# EAGLE design shield (EAGLE 6.6.0)

## Sheet 1 of 5
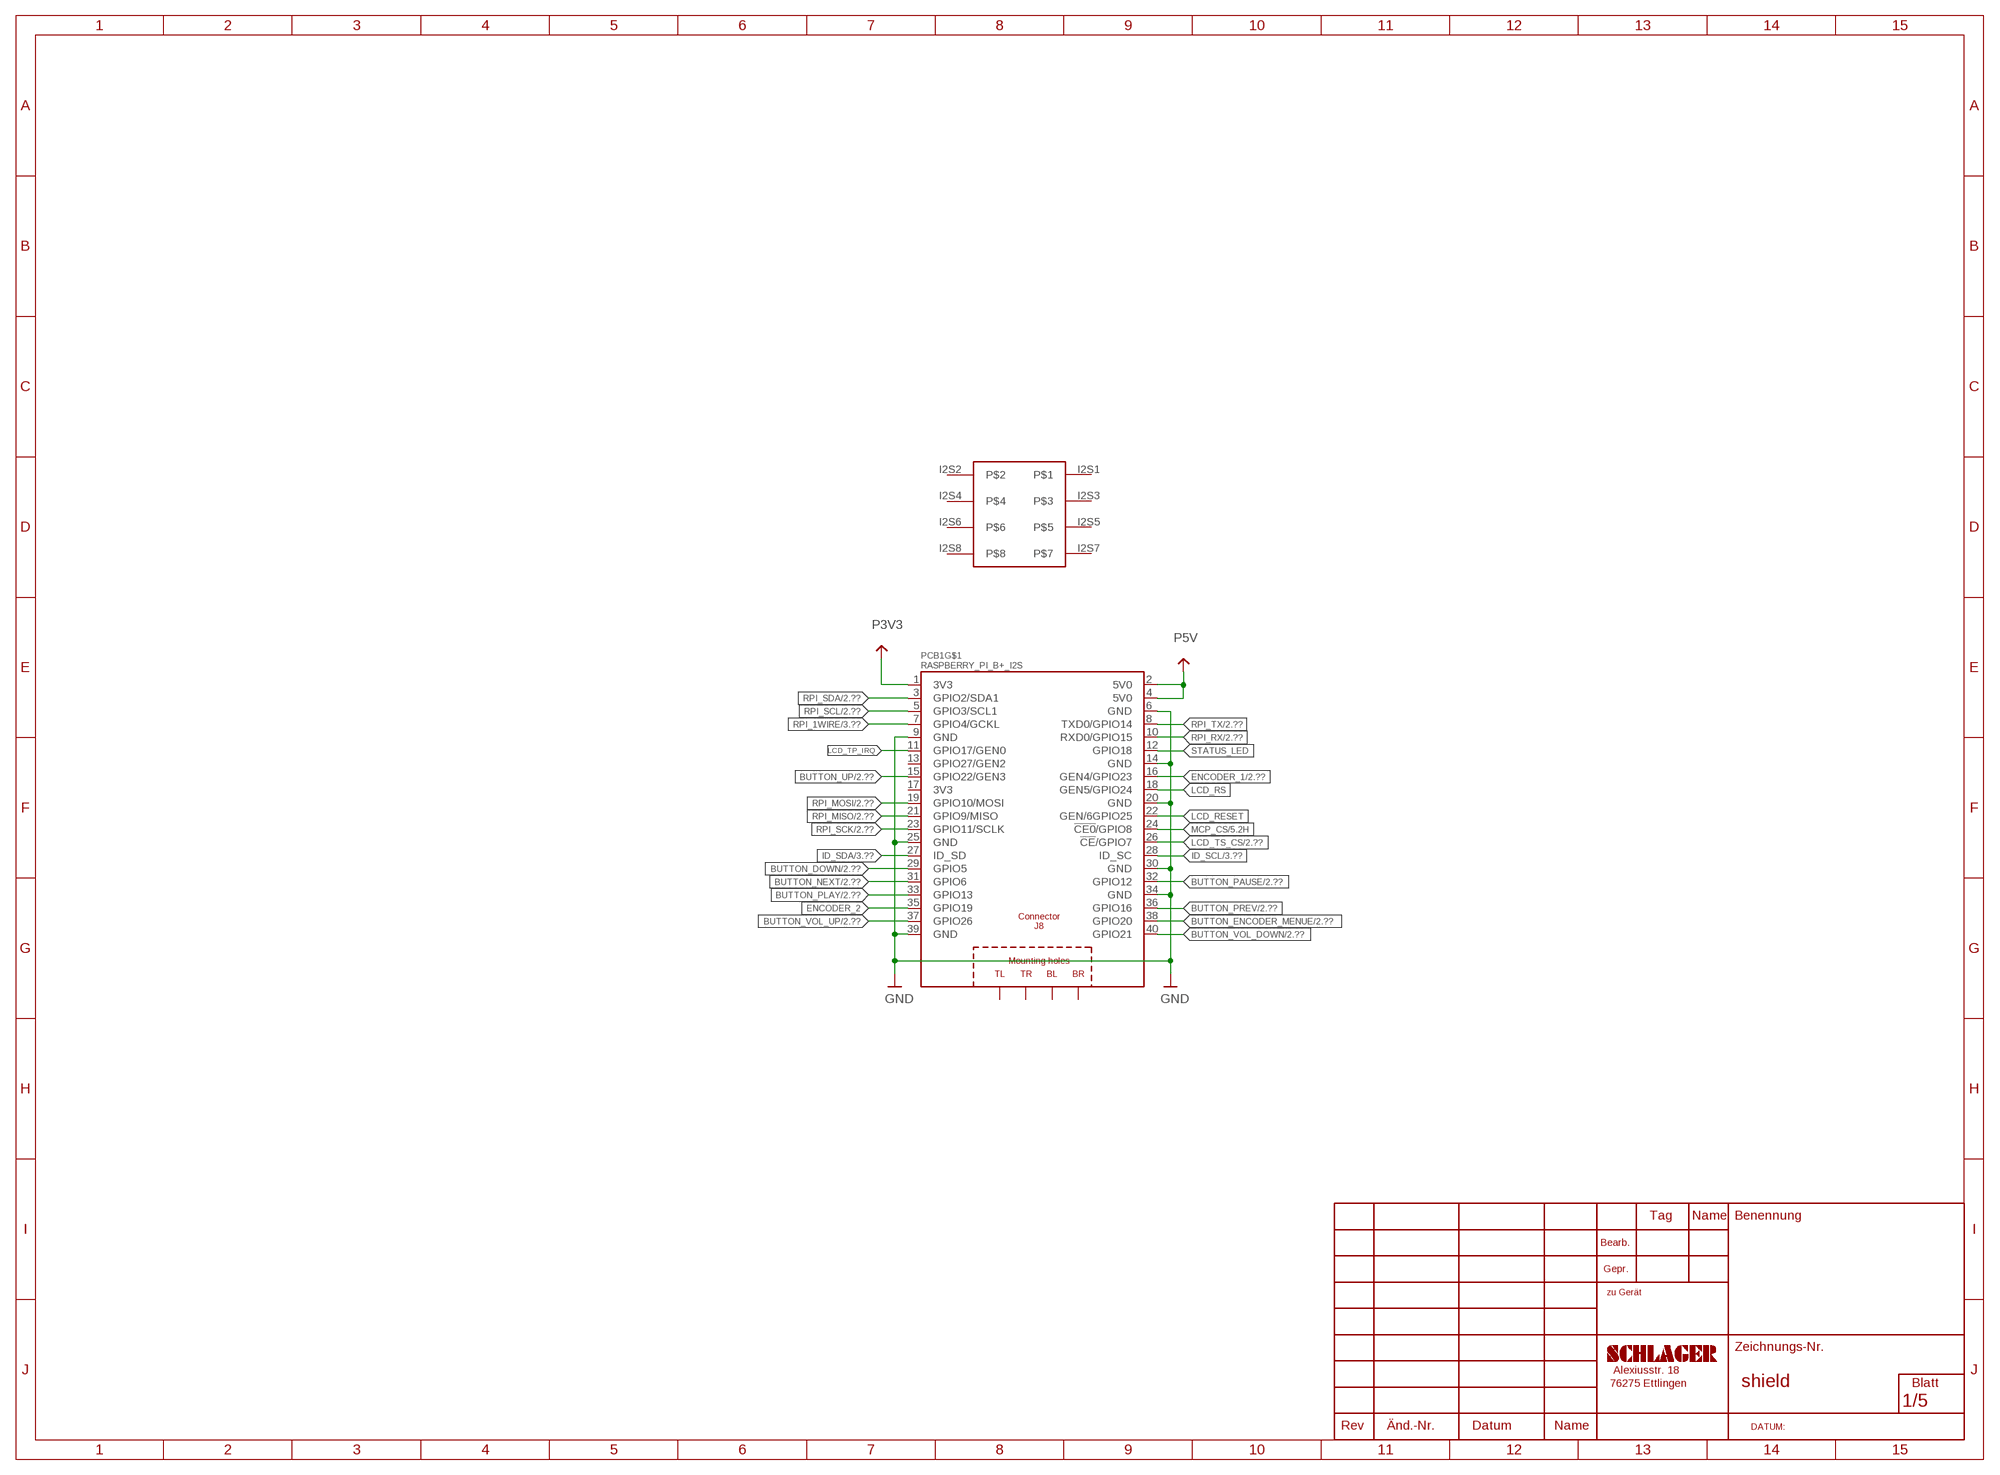
[diagram p0: schematic, sheet 1]

### Parts
PCB1  RASPBERRY_PI_B+_I2S  [RASPBERRY_PI_B+_I2S]

### Nets
BUTTON_DOWN: PCB1.29(GPIO5) ; also sheet 2
BUTTON_ENCODER_MENUE: PCB1.38(GPIO20) ; also sheet 2
BUTTON_NEXT: PCB1.31(GPIO6) ; also sheet 2
BUTTON_PAUSE: PCB1.32(GPIO12) ; also sheet 2
BUTTON_PLAY: PCB1.33(GPIO13) ; also sheet 2
BUTTON_PREV: PCB1.36(GPIO16) ; also sheet 2
BUTTON_UP: PCB1.15(GPIO22/GEN3) ; also sheet 2
BUTTON_VOL_DOWN: PCB1.40(GPIO21) ; also sheet 2
BUTTON_VOL_UP: PCB1.37(GPIO26) ; also sheet 2
ENCODER_1: PCB1.16(GEN4/GPIO23) ; also sheet 2
ENCODER_2: PCB1.35(GPIO19)
GND: PCB1.6(GND) PCB1.9(GND) PCB1.14(GND) PCB1.20(GND) PCB1.25(GND) PCB1.30(GND) PCB1.34(GND) PCB1.39(GND) ; also sheet 2,3,4,5
ID_SCL: PCB1.28(ID_SC) ; also sheet 3
ID_SDA: PCB1.27(ID_SD) ; also sheet 3
LCD_RESET: PCB1.22(GEN/6GPIO25)
LCD_RS: PCB1.18(GEN5/GPIO24)
LCD_TP_IRQ: PCB1.11(GPIO17/GEN0)
LCD_TS_CS: PCB1.26(!CE!/GPIO7) ; also sheet 2
MCP_CS: PCB1.24(!CE0!/GPIO8) ; also sheet 5
P3V3: PCB1.1(3V3) ; also sheet 2,3,5
P5V: PCB1.2(5V0) PCB1.4(5V0) ; also sheet 4,5
RPI_1WIRE: PCB1.7(GPIO4/GCKL) ; also sheet 3
RPI_MISO: PCB1.21(GPIO9/MISO) ; also sheet 2,5
RPI_MOSI: PCB1.19(GPIO10/MOSI) ; also sheet 2,5
RPI_RX: PCB1.10(RXD0/GPIO15) ; also sheet 2
RPI_SCK: PCB1.23(GPIO11/SCLK) ; also sheet 2,5
RPI_SCL: PCB1.5(GPIO3/SCL1) ; also sheet 2,3
RPI_SDA: PCB1.3(GPIO2/SDA1) ; also sheet 2,3
RPI_TX: PCB1.8(TXD0/GPIO14) ; also sheet 2
STATUS_LED: PCB1.12(GPIO18) ; also sheet 3
Unconnected: PCB1.13(GPIO27/GEN2) PCB1.17(3V3) PCB1.I2S1 PCB1.I2S2 PCB1.I2S3 PCB1.I2S4 PCB1.I2S5 PCB1.I2S6 PCB1.I2S7 PCB1.I2S8 PCB1.PE_BL(BL) PCB1.PE_BR(BR) PCB1.PE_TL(TL) PCB1.PE_TR(TR)

## Sheet 2 of 5
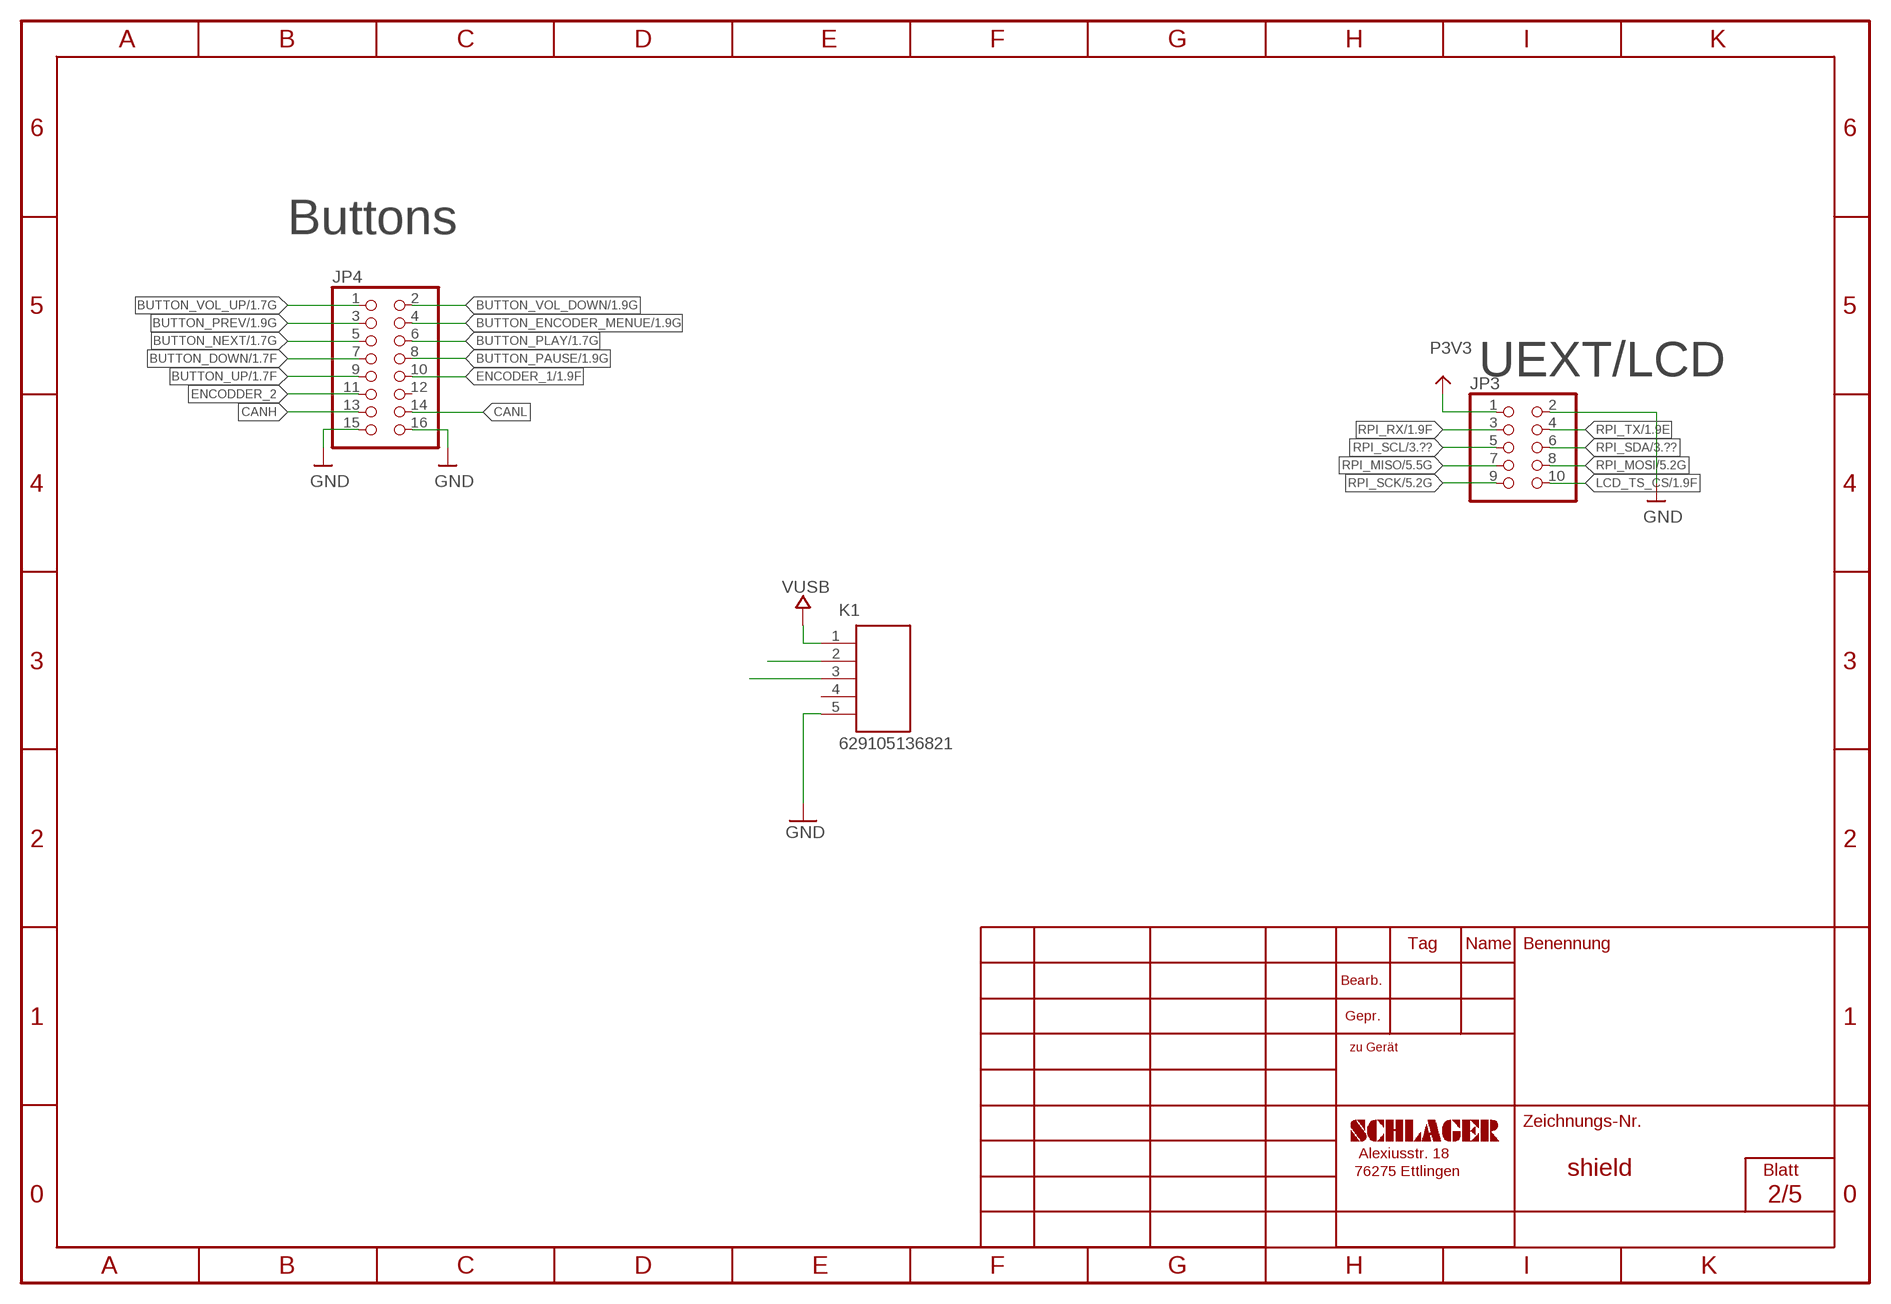
[diagram p1: schematic, sheet 2]

### Parts
JP3  PINHD-2X5/90  [2X05/90]
JP4  PINHD-2X8/90  [2X08/90]
K1  629105136821  [629105136821]

### Nets
BUTTON_DOWN: JP4.7 ; also sheet 1
BUTTON_ENCODER_MENUE: JP4.4 ; also sheet 1
BUTTON_NEXT: JP4.5 ; also sheet 1
BUTTON_PAUSE: JP4.8 ; also sheet 1
BUTTON_PLAY: JP4.6 ; also sheet 1
BUTTON_PREV: JP4.3 ; also sheet 1
BUTTON_UP: JP4.9 ; also sheet 1
BUTTON_VOL_DOWN: JP4.2 ; also sheet 1
BUTTON_VOL_UP: JP4.1 ; also sheet 1
CANH: JP4.13 ; also sheet 5
CANL: JP4.14 ; also sheet 5
ENCODDER_2: JP4.11
ENCODER_1: JP4.10 ; also sheet 1
GND: JP3.2 JP4.15 JP4.16 K1.5 ; also sheet 1,3,4,5
LCD_TS_CS: JP3.10 ; also sheet 1
N$8: K1.3
N$11: K1.2
P3V3: JP3.1 ; also sheet 1,3,5
RPI_MISO: JP3.7 ; also sheet 1,5
RPI_MOSI: JP3.8 ; also sheet 1,5
RPI_RX: JP3.3 ; also sheet 1
RPI_SCK: JP3.9 ; also sheet 1,5
RPI_SCL: JP3.5 ; also sheet 1,3
RPI_SDA: JP3.6 ; also sheet 1,3
RPI_TX: JP3.4 ; also sheet 1
VUSB: K1.1 ; also sheet 4
Unconnected: JP4.12 K1.4

### Notes on the sheet
- Buttons
- UEXT/LCD

## Sheet 3 of 5: 1wire
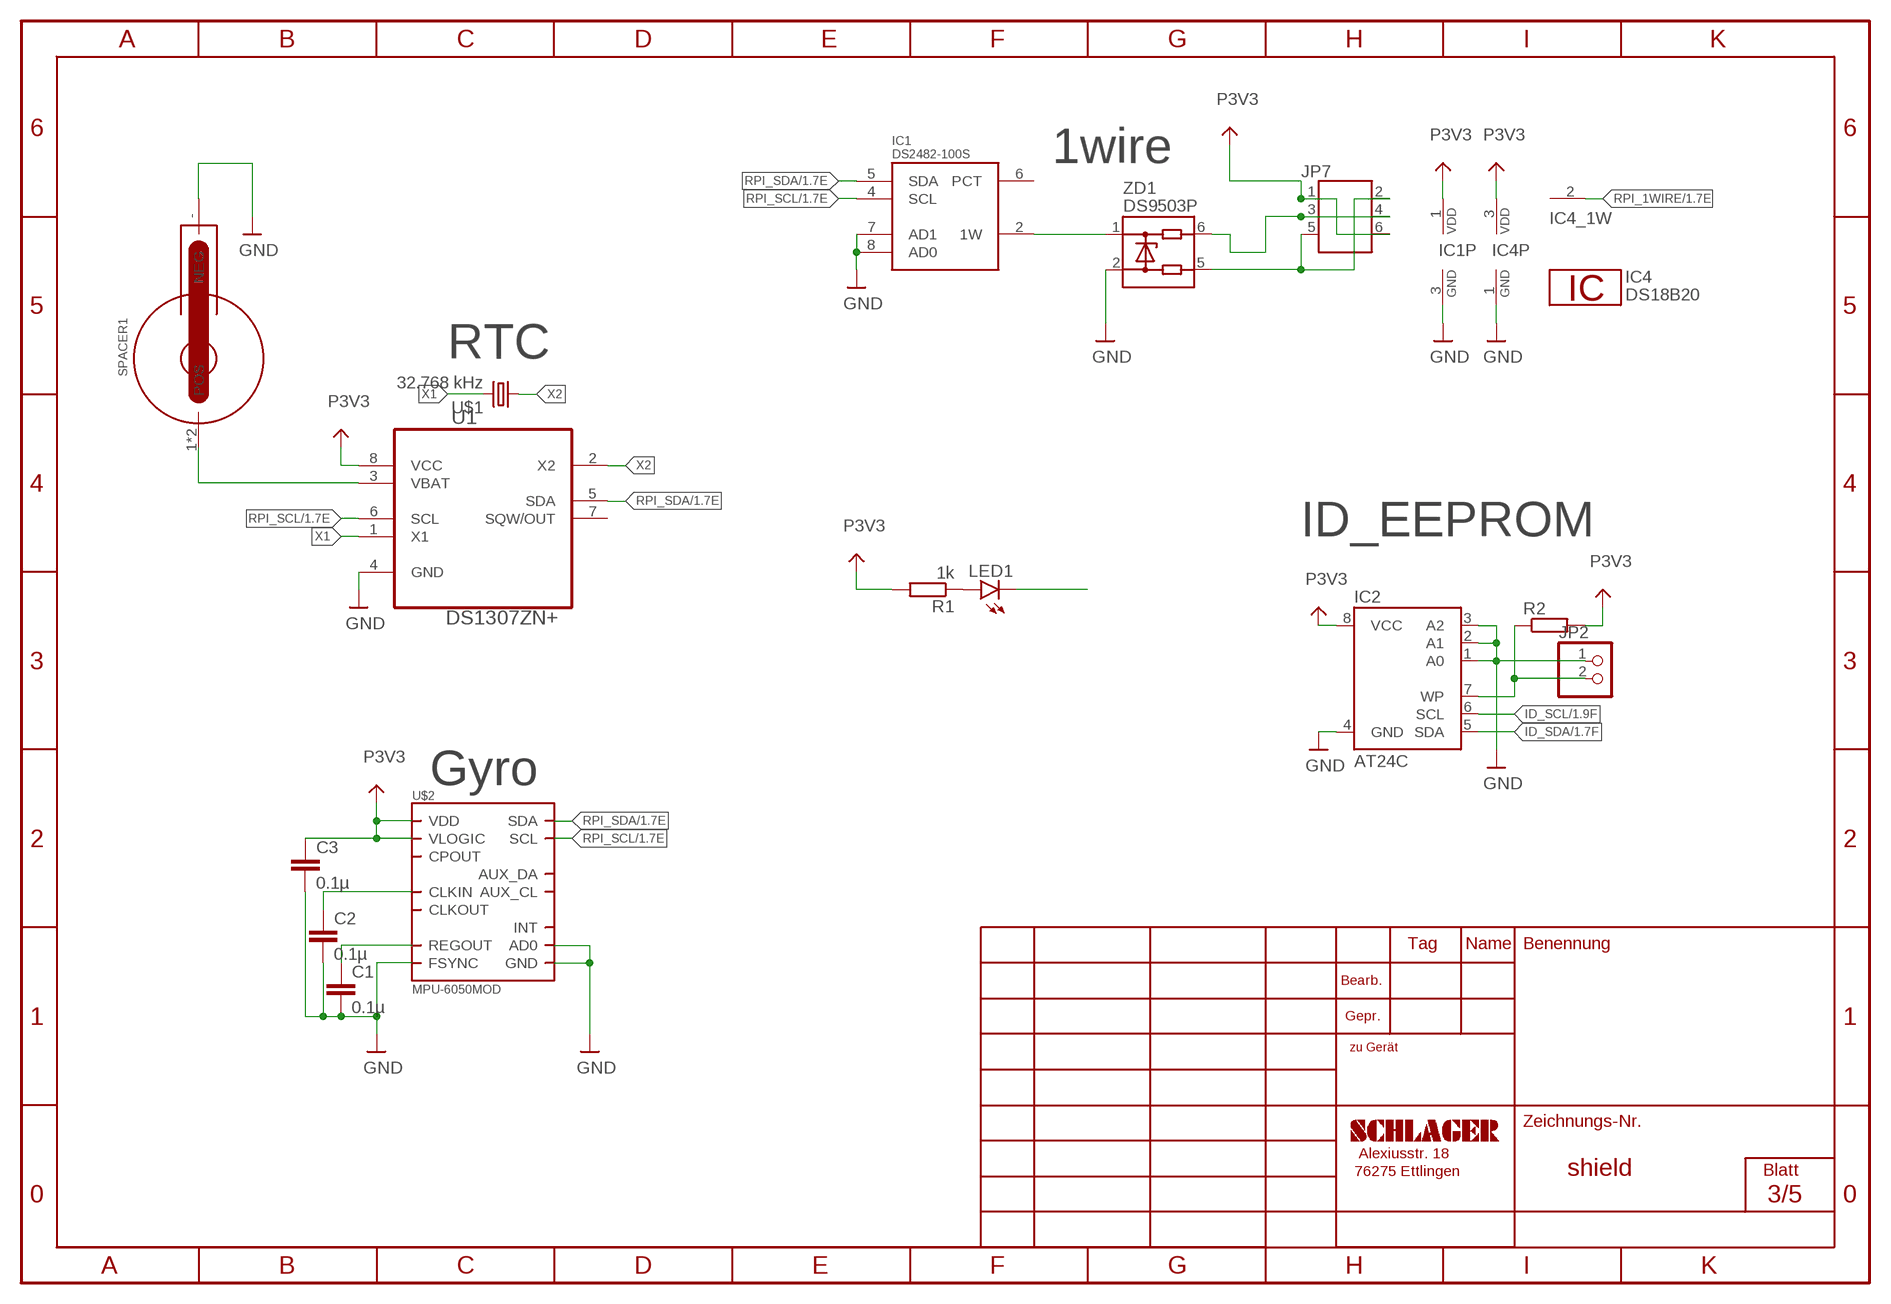
[diagram p2: schematic, sheet 3]

### Parts
C1  0.1µ  C-EUC0603K  [C0603K]
C2  0.1µ  C-EUC0603K  [C0603K]
C3  0.1µ  C-EUC0603K  [C0603K]
IC1  DS2482-100S  [SO08]
IC2  AT24C  [SO08]
IC4  DS18B20  [TO92-]
JP2  PINHD-1X2  [1X02]
JP7  610106249121"  [610106249121]
LED1  LED0603  [LED-0603]
R1  1k  R-EU_R0603  [R0603]
R2  R-EU_R0603  [R0603]
SPACER1  WA-BCMC_SMT_79523141  [79523141]
U1  DS1307ZN+  [SOIC127P600X175-8N]
U$1  32.768 kHz  CC5V-12,5  [CC5]
U$2  MPU-6050MOD  [QFN.24.4X4.MOD]
ZD1  DS9503P  [TSOC6]

### Nets
GND: C1.2 C2.2 C3.2 IC1.3(GND) IC1.7(AD1) IC1.8(AD0) IC2.1(A0) IC2.2(A1) IC2.3(A2) IC2.4(GND) IC4.1 JP2.1 SPACER1.-(NEG) U1.4(GND) U$2.9(AD0) U$2.11(FSYNC) U$2.18(GND) ZD1.2 ; also sheet 1,2,4,5
ID_SCL: IC2.6(SCL) ; also sheet 1
ID_SDA: IC2.5(SDA) ; also sheet 1
N$1: SPACER1.1(POS) SPACER1.2(POS) U1.3(VBAT)
N$2: JP7.2 JP7.5 ZD1.5
N$3: C1.1 U$2.10(REGOUT)
N$4: C2.1 U$2.1(CLKIN)
N$5: IC2.7(WP) JP2.2 R2.1
N$7: LED1.A R1.1
N$10: IC1.2(1W) ZD1.1
N$16: JP7.3 JP7.4 ZD1.6
P3V3: C3.1 IC1.1(VDD) IC2.8(VCC) IC4.3 JP7.1 JP7.6 R1.2 R2.2 U1.8(VCC) U$2.8(VLOGIC) U$2.13(VDD) ; also sheet 1,2,5
RPI_1WIRE: IC4.2 ; also sheet 1
RPI_SCL: IC1.4(SCL) U1.6(SCL) U$2.23(SCL) ; also sheet 1,2
RPI_SDA: IC1.5(SDA) U1.5(SDA) U$2.24(SDA) ; also sheet 1,2
STATUS_LED: LED1.C ; also sheet 1
X1: U1.1(X1) U$1.P$2
X2: U1.2(X2) U$1.P$1
Unconnected: IC1.6(PCT) U1.7(SQW/OUT) U$2.6(AUX_DA) U$2.7(AUX_CL) U$2.12(INT) U$2.20(CPOUT) U$2.22(CLKOUT)

### Notes on the sheet
- 1wire
- RTC
- ID_EEPROM
- Gyro

## Sheet 4 of 5
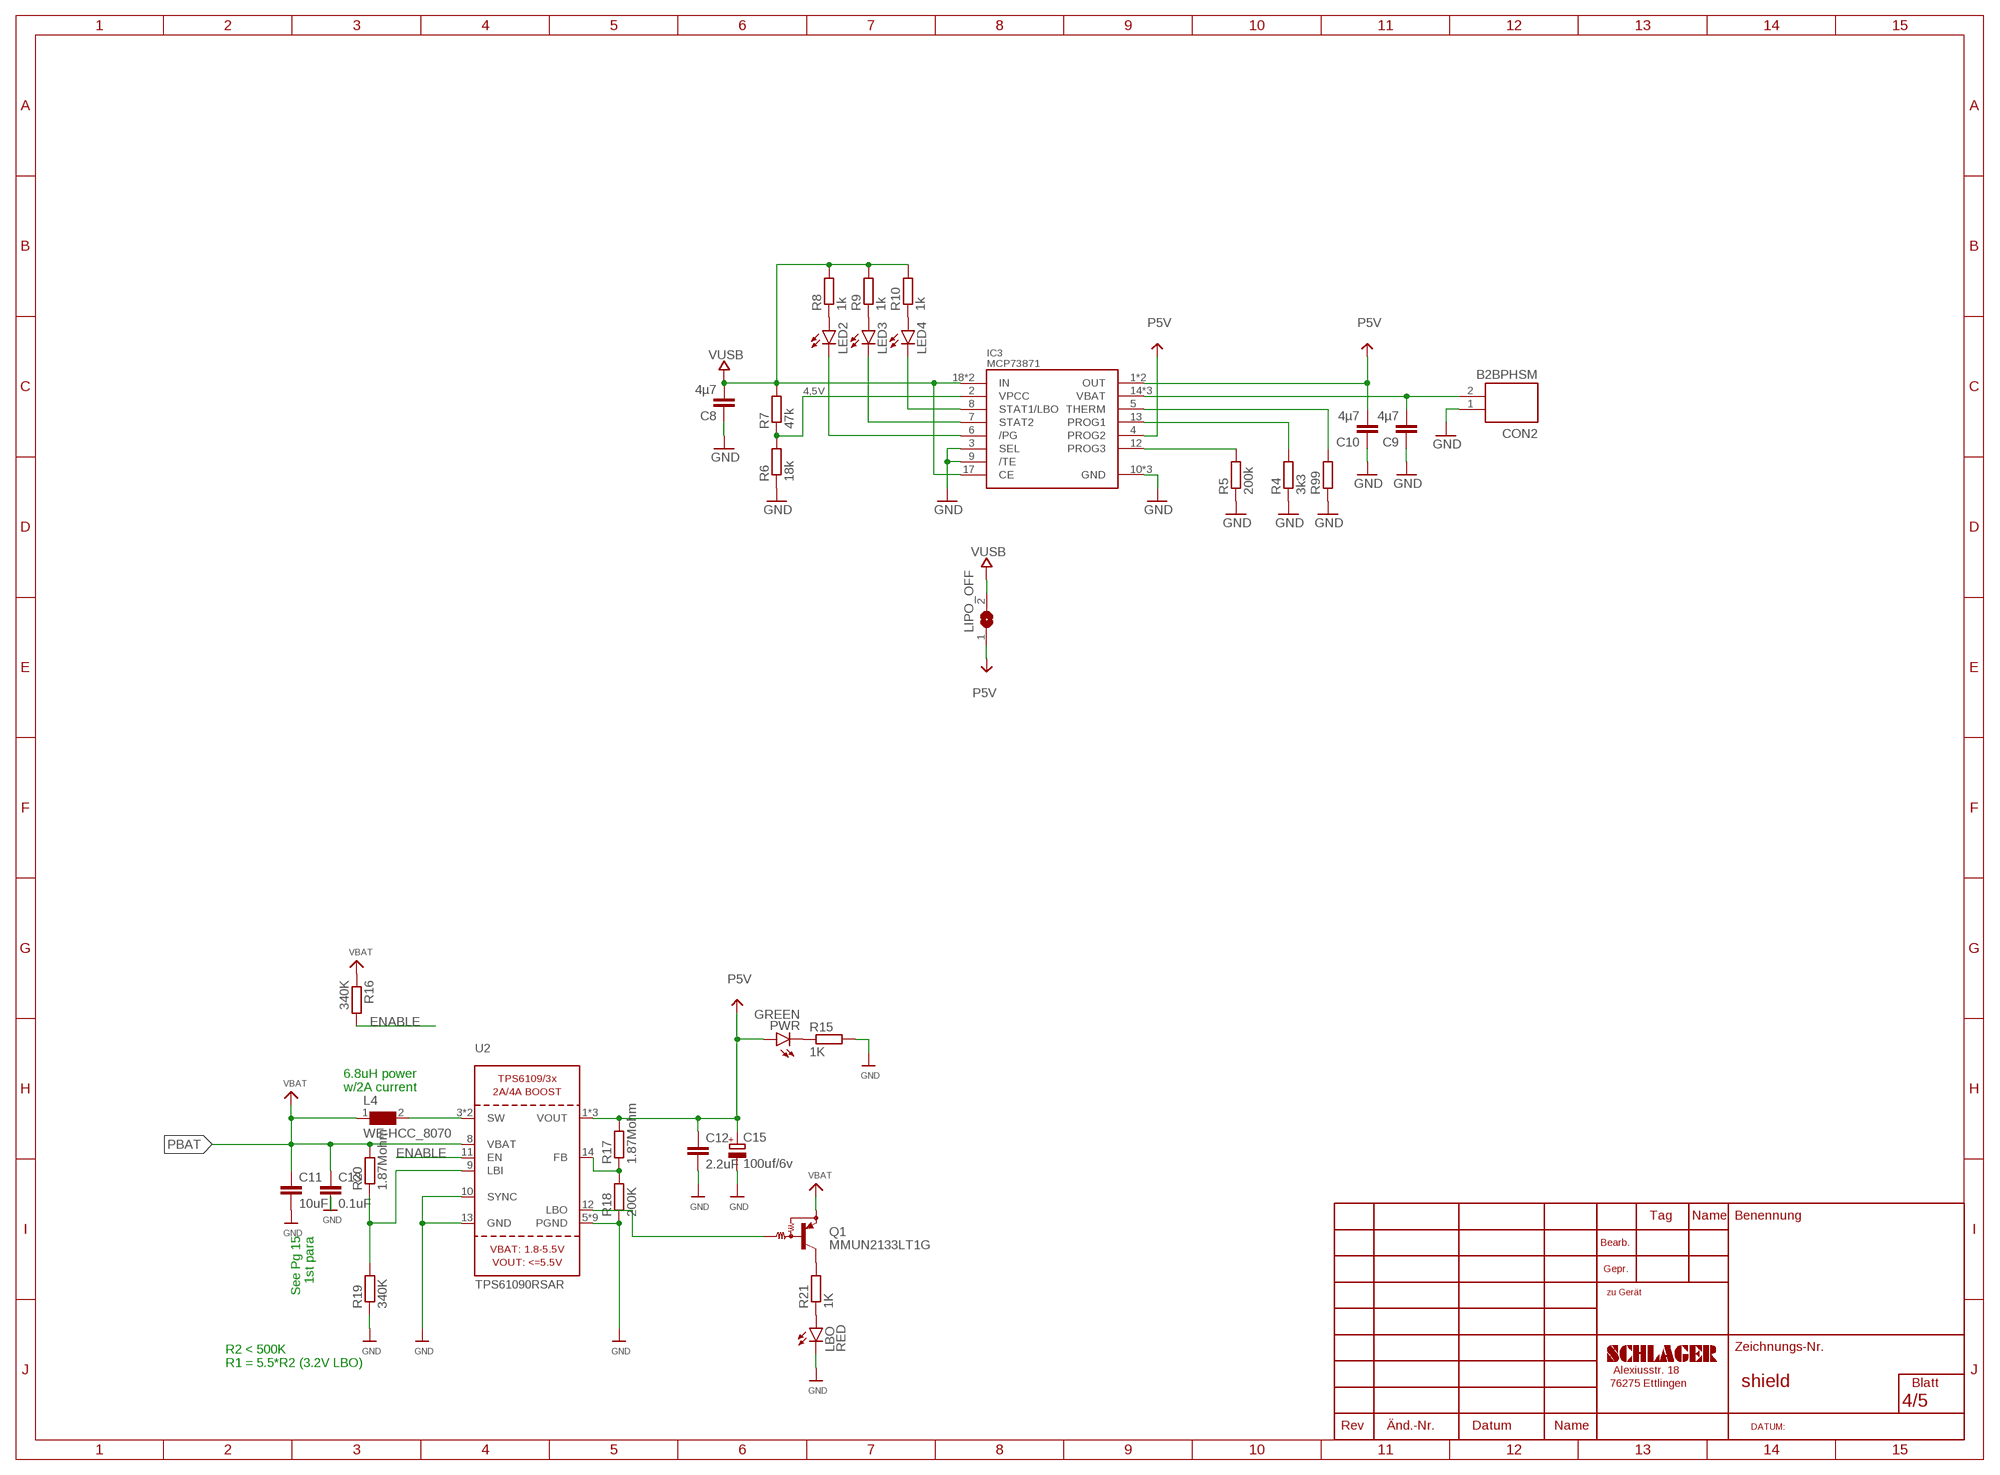
[diagram p3: schematic, sheet 4]

### Parts
C8  4µ7  C-EUC0603K  [C0603K]
C9  4µ7  C-EUC0603K  [C0603K]
C10  4µ7  C-EUC0603K  [C0603K]
C11  10uF  C-EUC1206  [C1206]
C12  2.2uF  C-EUC0603K  [C0603K]
C13  0.1uF  C-EUC0603K  [C0603K]
C15  100uf/6v  CPOL-EUB/3528-21W  [B/3528-21W]
CON2  B2BPHSM  [B2BPHSM]
IC3  MCP73871  [LQFN-20]
L4  WE-HCC_8070  [WE-HCC_8070]
LBO  RED  LED0603  [LED-0603]
LED2  LED0603  [LED-0603]
LED3  LED0603  [LED-0603]
LED4  LED0603  [LED-0603]
LIPO_OFF  SJN  [SJ]
PWR  GREEN  LED0603  [LED-0603]
Q1  MMUN2133LT1G  MUN2114T1-PNP_DRIVER-SC59-BEC  [SC59-BEC]
R4  3k3  R-EU_R0603  [R0603]
R5  200k  R-EU_R0603  [R0603]
R6  18k  R-EU_R0603  [R0603]
R7  47k  R-EU_R0603  [R0603]
R8  1k  R-EU_R0603  [R0603]
R9  1k  R-EU_R0603  [R0603]
R10  1k  R-EU_R0603  [R0603]
R15  1K  R-EU_R0603  [R0603]
R16  340K  R-EU_R0603  [R0603]
R17  1.87Mohm  R-EU_R0603  [R0603]
R18  200K  R-EU_R0603  [R0603]
R19  340K  R-EU_R0603  [R0603]
R20  1.87Mohm  R-EU_R0603  [R0603]
R21  1K  R-EU_R0603  [R0603]
R99  R-EU_R0603  [R0603]
U2  TPS61090RSAR  VREG_TPS6103X  [PVQFN-16]

### Nets
ENABLE: R16.2 U2.11(EN)
GND: C8.1 C9.1 C10.1 C11.2 C12.2 C13.2 C15.- CON2.1 IC3.3(SEL) IC3.9(/TE) IC3.10(GND) IC3.11(GND) IC3.EP(GND) LBO.C R4.1 R5.1 R6.1 R15.2 R18.1 R19.1 R99.1 U2.5(PGND) U2.6(PGND) U2.7(PGND) U2.10(SYNC) U2.13(GND) U2.P$18(PGND) U2.P$19(PGND) U2.P$20(PGND) U2.P$21(PGND) U2.P$22(PGND) U2.THERMAL(PGND) ; also sheet 1,2,3,5
LBO: Q1.B U2.12(LBO)
N$9: L4.2 U2.3(SW) U2.4(SW)
N$12: IC3.5(THERM) R99.2
N$13: IC3.13(PROG1) R4.2
N$14: IC3.12(PROG3) R5.2
N$15: IC3.2(VPCC) R6.2 R7.1
N$17: LED2.A R8.1
N$18: LED3.A R9.1
N$19: LED4.A R10.1
N$20: IC3.8(STAT1/LBO) LED4.C
N$21: IC3.7(STAT2) LED3.C
N$22: IC3.6(/PG) LED2.C
N$23: R19.2 R20.1 U2.9(LBI)
N$24: PWR.C R15.1
N$25: R17.1 R18.2 U2.14(FB)
N$26: LBO.A R21.1
N$27: Q1.C R21.2
P5V: C10.2 C12.1 C15.+ IC3.1(OUT) IC3.4(PROG2) IC3.20(OUT) LIPO_OFF.1 PWR.A R17.2 U2.1(VOUT) U2.15(VOUT) U2.16(VOUT) ; also sheet 1,5
PBAT: C9.2 C11.1 C13.1 CON2.2 IC3.14(VBAT) IC3.15(VBAT) IC3.16(VBAT) L4.1 R20.2 U2.8(VBAT) ; supply symbol labelled VBAT
VBAT: Q1.E R16.1
VUSB: C8.2 IC3.17(CE) IC3.18(IN) IC3.19(IN) LIPO_OFF.2 R7.2 R8.2 R9.2 R10.2 ; also sheet 2

### Notes on the sheet
- 4,5V
- 6.8uH power
  w/2A current
- See Pg 15
  1st para
- R2 < 500K
  R1 = 5.5*R2 (3.2V LBO)

## Sheet 5 of 5
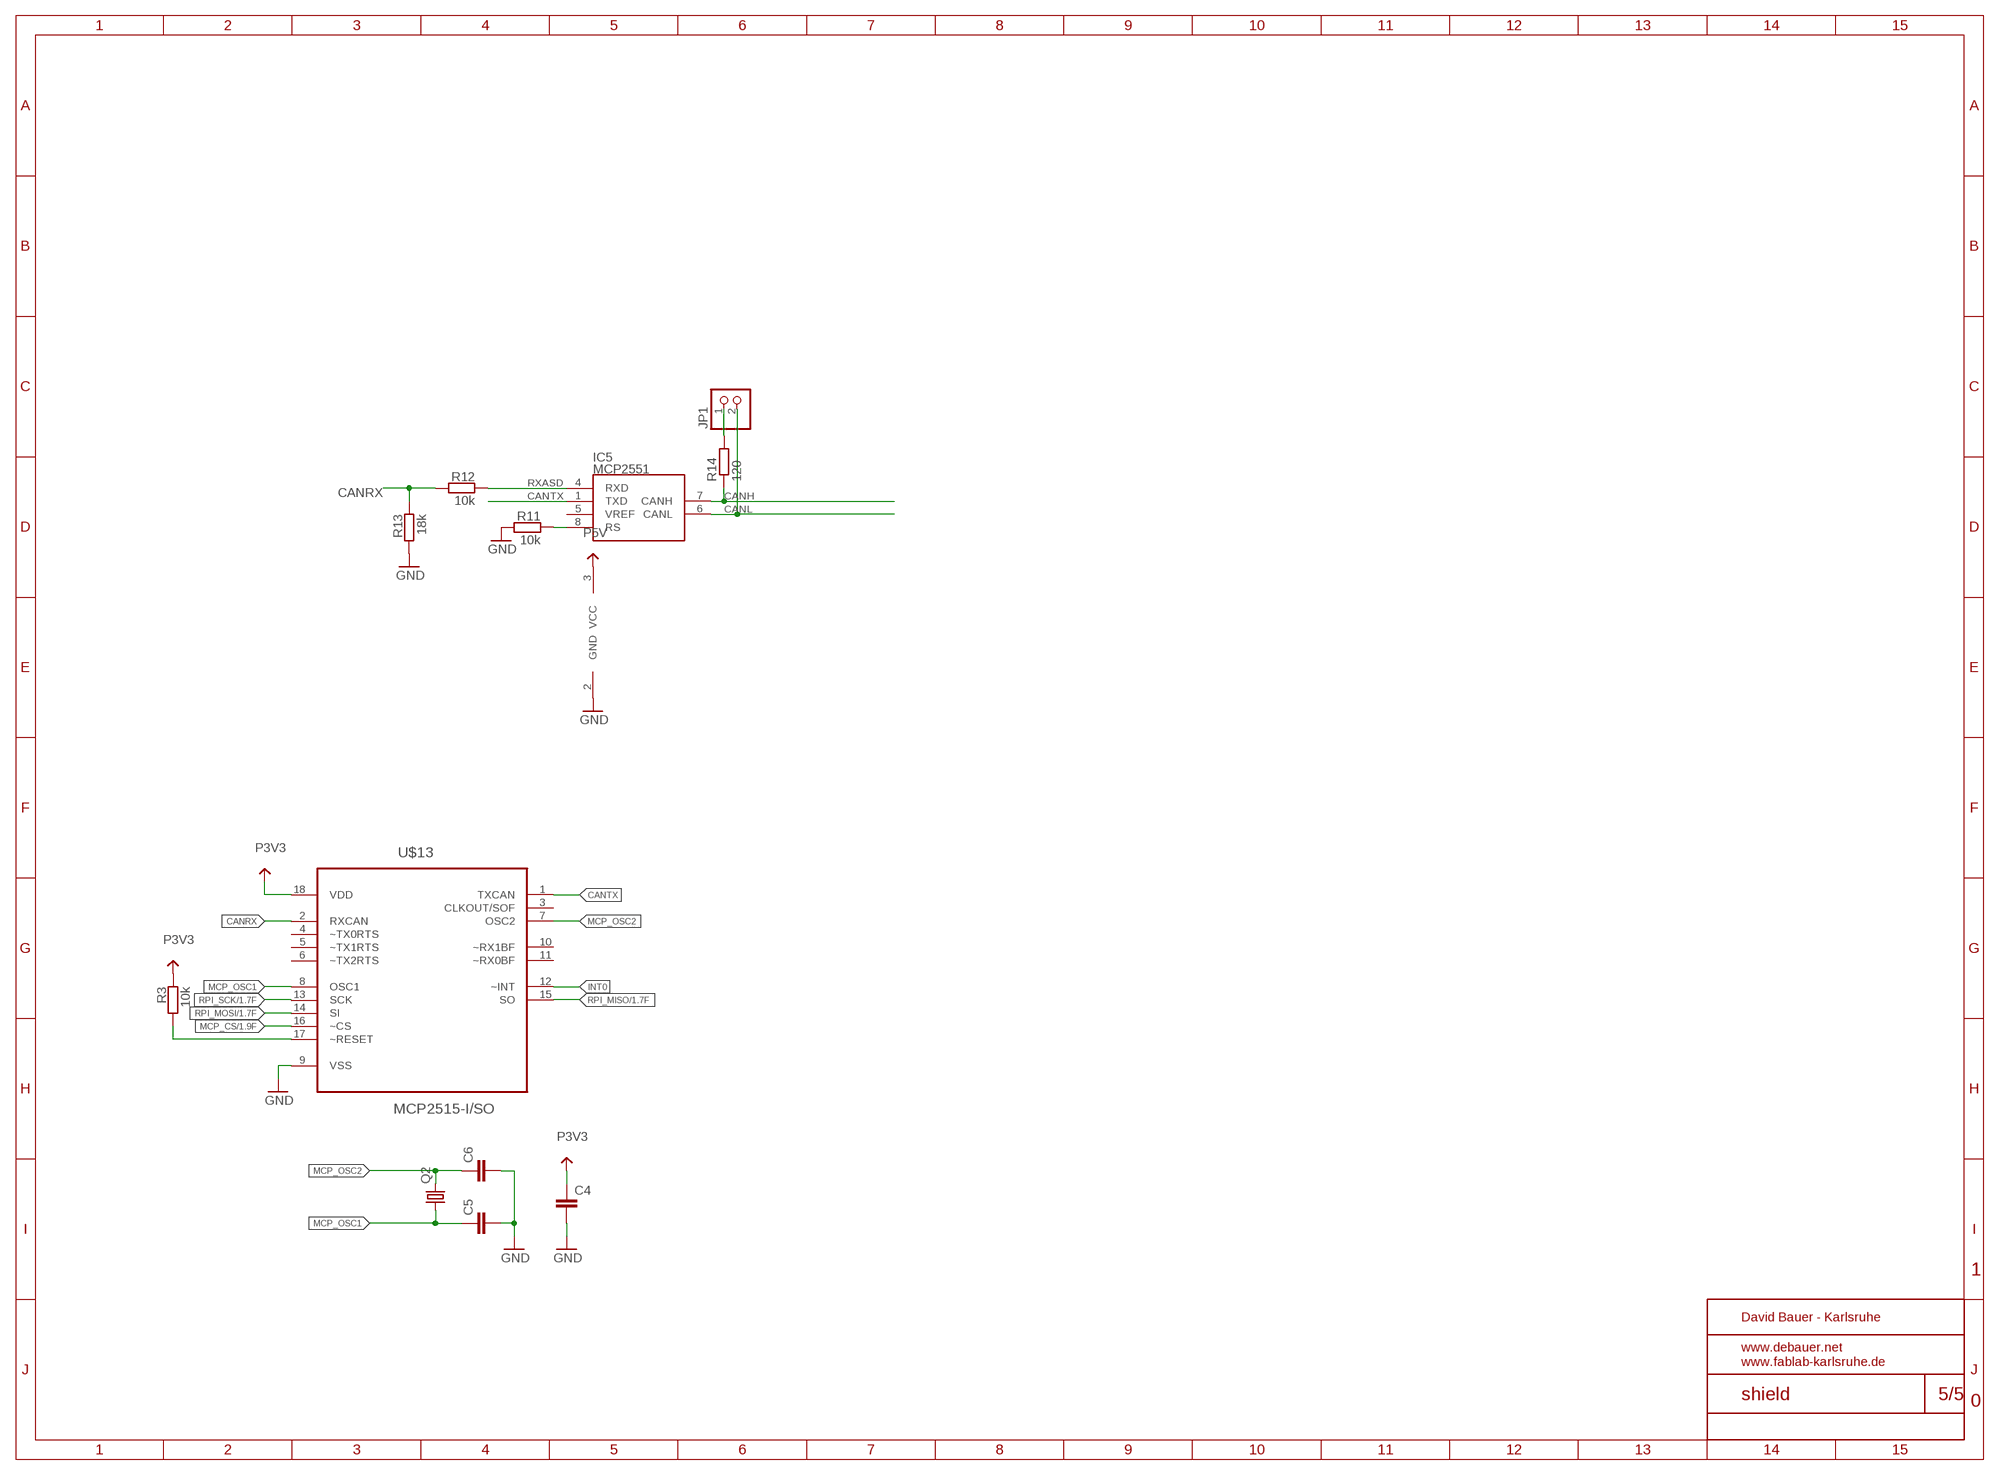
[diagram p4: schematic, sheet 5]

### Parts
C4  C-EUC0603K  [C0603K]
C5  C-EUC0603K  [C0603K]
C6  C-EUC0603K  [C0603K]
IC5  MCP2551  [SO-8]
JP1  PINHD-1X2  [1X02]
Q2  CRYSTALHC49S  [HC49/S]
R3  10k  R-EU_R0603  [R0603]
R11  10k  R-EU_R0603  [R0603]
R12  10k  R-EU_R0603  [R0603]
R13  18k  R-EU_R0603  [R0603]
R14  120  R-EU_R0603  [R0603]
U$13  MCP2515-I/SO  [SOIC127P1034X264-18N]

### Nets
CANH: IC5.7(CANH) R14.1 ; also sheet 2
CANL: IC5.6(CANL) JP1.2 ; also sheet 2
CANRX: R12.2 R13.1 U$13.2(RXCAN)
CANTX: IC5.1(TXD) U$13.1(TXCAN)
GND: C4.2 C5.2 C6.2 IC5.2(GND) R11.2 R13.2 U$13.9(VSS) ; also sheet 1,2,3,4
INT0: U$13.12(~INT)
MCP_CS: U$13.16(~CS) ; also sheet 1
MCP_OSC1: C5.1 Q2.1 U$13.8(OSC1)
MCP_OSC2: C6.1 Q2.2 U$13.7(OSC2)
N$6: R3.2 U$13.17(~RESET)
N$28: IC5.8(RS) R11.1
N$29: JP1.1 R14.2
P3V3: C4.1 R3.1 U$13.18(VDD) ; also sheet 1,2,3
P5V: IC5.3(VCC) ; also sheet 1,4
RPI_MISO: U$13.15(SO) ; also sheet 1,2
RPI_MOSI: U$13.14(SI) ; also sheet 1,2
RPI_SCK: U$13.13(SCK) ; also sheet 1,2
RXASD: IC5.4(RXD) R12.1
Unconnected: IC5.5(VREF) U$13.3(CLKOUT/SOF) U$13.4(~TX0RTS) U$13.5(~TX1RTS) U$13.6(~TX2RTS) U$13.10(~RX1BF) U$13.11(~RX0BF)

## Library data of the parts
C1-C6 C8-C10 C12 C13 = debauer_passiv:C-EU: CAPACITOR, European symbol
C11 = schlager_passiv:C-EU: CAPACITOR, European symbol
C15 = schlager_passiv:CPOL-EU: POLARIZED CAPACITOR, European symbol
CON2 = CAB:B2BPHSM
IC1 = 1wire:DS2482-100: I2C to 1-Wire Host Adapter/Line Driver This device is a onewire host and I2C interface in one chip. It provides the complete DC/AC requirements for onewire communication, including overdrive speed mode, but, unlike the DS2480B chip, no 12V EPROM programming. Notes: For overdrive speed and 5V EEPROM programming, an external active pullup circuit must be connected to the 1W, VDD and PCT pin. See the datasheet for details. The lower two I2C adress bits of the chip can be selected by external pins, so up to 4 chips may be connected to the same I2C bus. Author: Orginal device and description from Giovanni Varasano <giovanni.varasano@fastwebnet.it> Improved by Jan Kandziora <jjj@gmx.de>
IC2 = schlager_ics:AT24C*: 2-wire serial EEPROM
IC3 = MYMCHIP:MCP73871: Batteriemanagement
IC4 = 1wire:DS18B20: Programmable Resolution Digital Thermometer This chip provides a onewire thermosensor with approx. 0.5°C accuracy. A programmable over/undertemperure alarm is available. The precision can be set from 9..12 bits. Notes: Vdd must be applied for accurate measurements at low temperatures, as the parasite power circuit otherwise heats the sensor. If parasite power is used, Vdd has to be connected to GND. The DS1822 is a low-cost thermometer chip, the DS18S20 is similar to the DS18B20, but with 9 Bit precision only. Author: Jan Kandziora <jjj@gmx.de>
IC5 = MYMCHIP:MCP2551: CAN Transceiver
JP1 JP2 = pinhead:PINHD-1X2: PIN HEADER
JP3 = pinhead:PINHD-2X5: PIN HEADER
JP4 = pinhead:PINHD-2X8: PIN HEADER
JP7 = Wuerth_Board-to-Board:610106249121: WR-PHD 2.54 mm Dual Pin Header 6 pins, dual pin, SMT horizontal, gold plating;=>Code : Con_BTB_PHD_2.54_2_6101xx249121_610106249121 <http://katalog.we-online.de/media/images/eican/Con_BTB_PHD_2.54_2_6101xx249121_pf2.jpg> Details see: http://katalog.we-online.de/em/datasheet/6101xx249121.pdf Created 2014-10-08, Karrer Zheng 2014 (C) Wurth Elektronik
K1 = Wuerth_Elektronik_eiCan_Communication_Connectors:629105136821: WR-COM SMT Horizontal 5 Contacts Micro USB Type B,5 pins
L4 = Wuerth_Elektronik_eiSos_V6:WE-HCC: SMD High Current Cube Inductor WE-HCC - magnetically shieled - current capability up to 27A - excellent saturation characteristics -- filter choke for DC/DC converter -- single and polyphase buck converter -- filter choke for motor electronics
LBO LED1-LED4 PWR = debauer_led:LED: LEDs Standard schematic elements and footprints for 5mm, 3mm, 1206, and 0603 sized LEDs. 5mm - Spark Fun Electronics SKU : COM-00529 (and others)
LIPO_OFF = jumper:SJ: SMD solder JUMPER
PCB1 = debauer_modules:RASPBERRY_PI_B+_I2S: Raspberry Pi B+ Based on issue: Thursday, July 10, 2014 - Rev 1.2 LBR by Tim R. 07-2014
Q1 = transistor:*-PNP_DRIVER-: PNP Bias Resistor Transistor
Q2 = crystal:CRYSTAL: CRYSTAL; OC_FARNELL: 1667008; OC_NEWARK: unknown
R1-R21 R99 = debauer_passiv:R-EU_: RESISTOR, European symbol
SPACER1 = Wurth_Elektronik_Electromechanic_Assembly_Spacer_rev16a:WA-BCMC: Battery Holder WA-BCMC Characteristics Material : Phosphor Bronze Surface:Nichel Comliance:Lead free and RoHs Packaging unit is 500 <http://katalog.we-online.de/media/images/v2/Family_WA-BCMC_Battery_Holder_795xxxxx.jpg> Details see: http://katalog.we-online.de/en/em/BCMC_BATTERY_HOLDER/79523141 2015 (C) Wurth Elektronik
U1 = schlager_ics:DS1307ZN+: 64 x 8, Serial, I2C Real-Time Clock; MPN: DS1307ZN+; OC_FARNELL: 9725253; OC_NEWARK: 96K8872; PACKAGE: SOIC-8; SUPPLIER: Maxim
U2 = microbuilder:VREG_TPS6103X: TPS6103x 4A Boost - 1.8-5.5V Input, Adjustable Output to 5.5V
U$1 = schlager_Quarze:CC5V; MPN: CC5V-T1A 32,768KHZ 12,5PF; OC_FARNELL: 1539374RL; OC_REICHELT: 32,768 CC5V-12,5
U$2 = debauer_ics:MPU-6050
U$13 = schlager_ics:MCP2515-I/SO: CAN Controller; MPN: MCP2515-I/SO; OC_FARNELL: 1292239; OC_NEWARK: 29H7136; PACKAGE: SOIC-18; SUPPLIER: Microchip
ZD1 = 1wire:DS9503: ESD Protection Diode with Resistors This ESD protection diode is designed especially for onewire host interfaces. Unlike the DS9502, it has two additional 5Ohm resitors in the 1W and GND line. Pin 5 and 6 have to be connected to the host side, pin 1 und 2 to the network side. The 1W line is through pin 1 and 6, the GND line is through pin 2 and 5. Author: Jan Kandziora <jjj@gmx.de>

## Net classes
4 USBpair: width 0.254 mm, drill 0.406 mm, clearance 0.508 mm

## Board
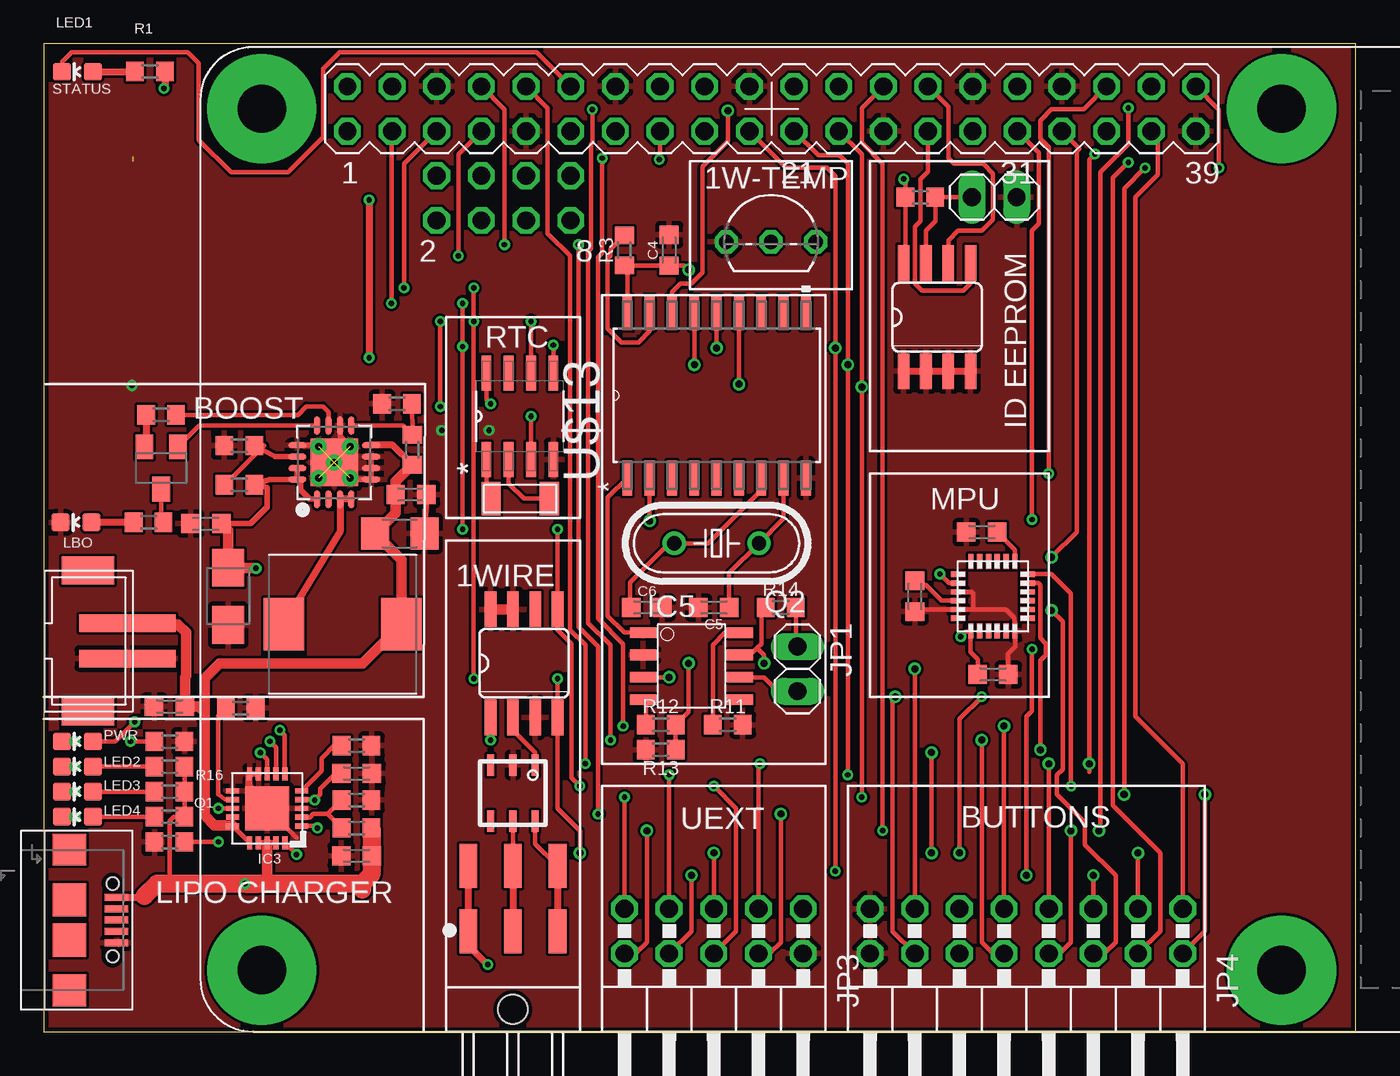
[diagram p5: board, top side]
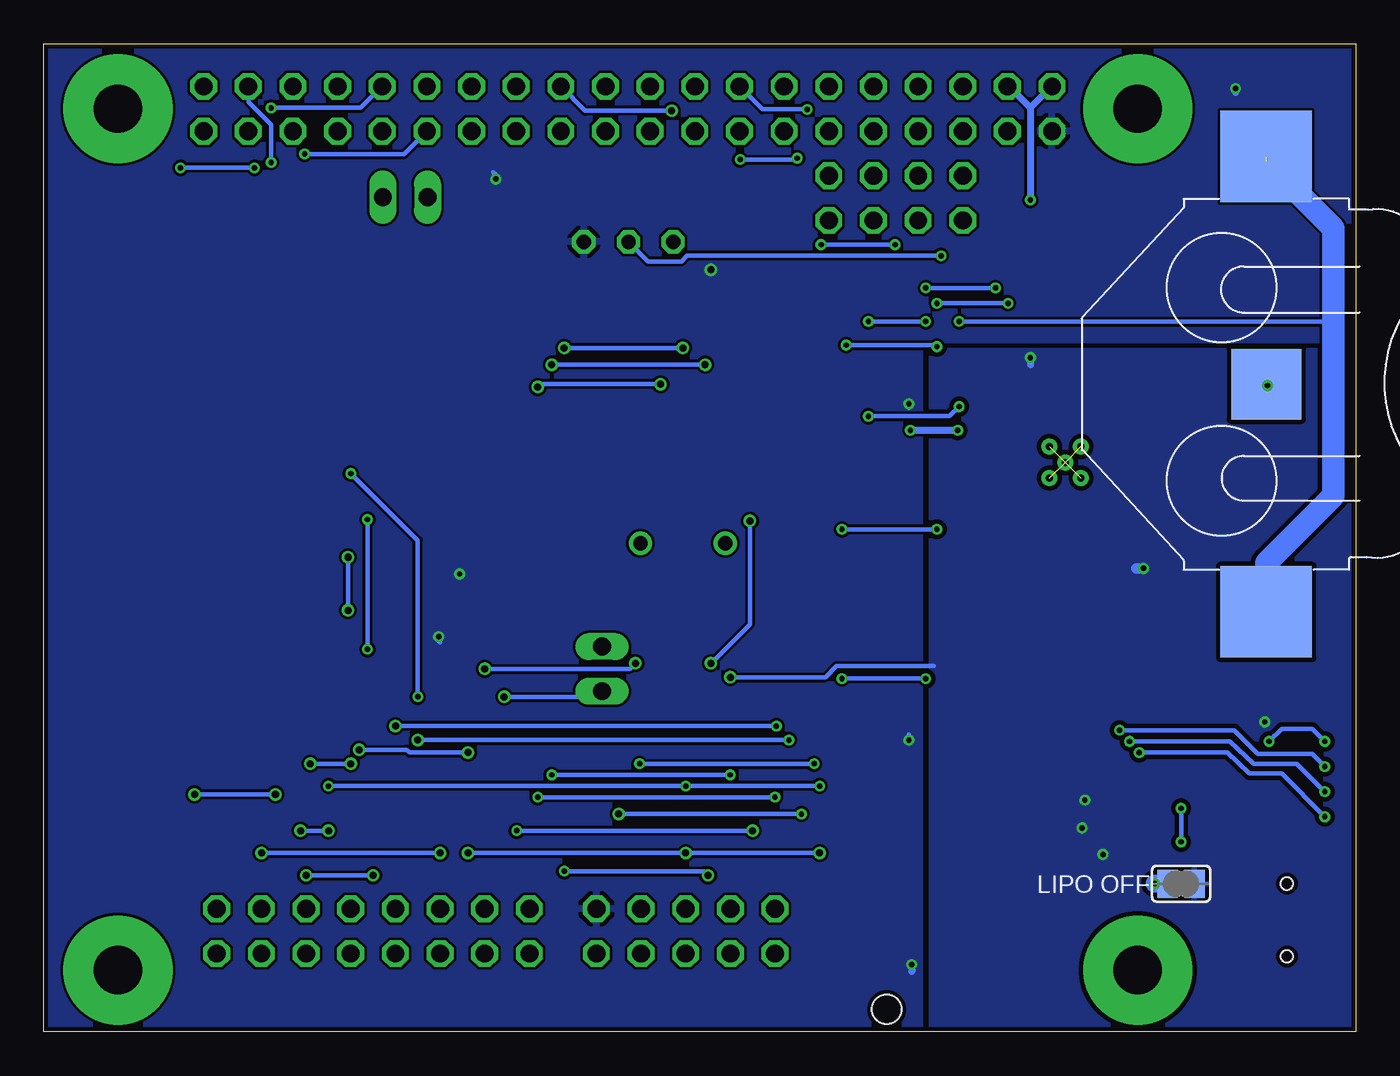
[diagram p6: board, bottom side, seen from below]

Size 74.6 x 56.19 mm. Coordinates in mm from the lower left corner, seen from the top.
Outline: 0,0 74.6,0 74.6,56.19 0,56.19 0,0
Copper layers (1*16): Top 0.035mm / dielectric 1.5mm / Bottom 0.035mm
Design rules "ITEADstudio_DRC": minimum track width 6mil, minimum drill 12mil, track to track 6mil, track to pad 6mil, pad to pad 6mil, via to via 6mil, smd to smd 0mil, copper to edge 10mil, drill to drill 10mil, minimum pad ring 10mil, minimum via ring 6mil, stop-mask expansion 2mil, vias tented up to drill 100mil, thermal gap 10mil

### Footprints (pad centres in the part's own frame; a part is rotated, then mirrored left to right if it is on the bottom)
C0603K = smd 1.05 x 1.08: 1 -0.875,0; 2 0.875,0
C1206 = smd 1.6 x 1.8: 1 -1.4,0; 2 1.4,0
B/3528-21W = smd 2.15 x 1.8: + 1.625,0; - -1.625,0
B2BPHSM = smd 1 x 5.5: 1 1,4.75; 2 -1,4.75 | smd 1.6 x 3: B1 4,2.5; B2 -4,2.5
SO08 = smd 0.66 x 2.032: 1 -1.905,-3.073; 2 -0.635,-3.073; 3 0.635,-3.073; 4 1.905,-3.073; 5 1.905,3.073; 6 0.635,3.073; 7 -0.635,3.073; 8 -1.905,3.073
LQFN-20 = smd 0.73 x 0.3: 1 -1.965,1; 2 -1.965,0.5; 3 -1.965,0; 4 -1.965,-0.5; 5 -1.965,-1; 11 1.965,-1; 12 1.965,-0.5; 13 1.965,0; 14 1.965,0.5; 15 1.965,1 | smd 0.3 x 0.73: 6 -1,-1.965; 7 -0.5,-1.965; 8 0,-1.965; 9 0.5,-1.965; 10 1,-1.965; 16 1,1.965; 17 0.5,1.965; 18 0,1.965; 19 -0.5,1.965; 20 -1,1.965 | smd 2.5 x 2.5: EP 0,0
TO92- = drill 0.813 octagon: 1 -2.54,0; 2 0,0; 3 2.54,0
SO-8 = smd 0.61 x 1.524: 1 0,-0.203; 2 1.27,-0.203; 3 2.54,-0.203; 4 3.81,-0.203; 5 3.81,5.283; 6 2.54,5.283; 7 1.27,5.283; 8 0,5.283
1X02 = drill 1.016 long: 1 -1.27,0; 2 1.27,0
2X05/90 = drill 1.016 octagon: 1 -5.08,-6.35; 2 -5.08,-3.81; 3 -2.54,-6.35; 4 -2.54,-3.81; 5 0,-6.35; 6 0,-3.81; 7 2.54,-6.35; 8 2.54,-3.81; 9 5.08,-6.35; 10 5.08,-3.81
2X08/90 = drill 1.016 octagon: 1 -8.89,-6.35; 2 -8.89,-3.81; 3 -6.35,-6.35; 4 -6.35,-3.81; 5 -3.81,-6.35; 6 -3.81,-3.81; 7 -1.27,-6.35; 8 -1.27,-3.81; 9 1.27,-6.35; 10 1.27,-3.81; 11 3.81,-6.35; 12 3.81,-3.81; 13 6.35,-6.35; 14 6.35,-3.81; 15 8.89,-6.35; 16 8.89,-3.81
610106249121 = smd 1 x 2.5: 1 -2.54,4.45; 2 0,4.45; 3 2.54,4.45; 4 2.54,8.15; 5 0,8.15; 6 -2.54,8.15 | hole 1.68: 0,0
629105136821 = smd 0.4 x 1.35: 1 -1.3,0; 2 -0.65,0; 3 0,0; 4 0.65,0; 5 1.3,0 | smd 1.8 x 1.9: Z1 -4,-2.675; Z4 4,-2.675 | smd 1.9 x 1.9: Z2 -1.15,-2.675; Z3 1.15,-2.675 | hole 0.7: -2.075,-0.225; 2.075,-0.225
WE-HCC_8070 = smd 2.3 x 3: 1 -3.35,0; 2 3.35,0
LED-0603 = smd 1 x 1: A 0,-0.877; C 0,0.877
SJ = smd 1.168 x 1.6: 1 -0.762,0; 2 0.762,0
RASPBERRY_PI_B+_I2S = drill 1.016 octagon: 1 8.37,51.23; 2 8.37,53.77; 3 10.91,51.23; 4 10.91,53.77; 5 13.45,51.23; 6 13.45,53.77; 7 15.99,51.23; 8 15.99,53.77; 9 18.53,51.23; 10 18.53,53.77; 11 21.07,51.23; 12 21.07,53.77; 13 23.61,51.23; 14 23.61,53.77; 15 26.15,51.23; 16 26.15,53.77; 17 28.69,51.23; 18 28.69,53.77; 19 31.23,51.23; 20 31.23,53.77; 21 33.77,51.23; 22 33.77,53.77; 23 36.31,51.23; 24 36.31,53.77; 25 38.85,51.23; 26 38.85,53.77; 27 41.39,51.23; 28 41.39,53.77; 29 43.93,51.23; 30 43.93,53.77; 31 46.47,51.23; 32 46.47,53.77; 33 49.01,51.23; 34 49.01,53.77; 35 51.55,51.23; 36 51.55,53.77; 37 54.09,51.23; 38 54.09,53.77; 39 56.63,51.23; 40 56.63,53.77; I2S1 13.45,48.69; I2S2 13.45,46.15; I2S3 15.99,48.69; I2S4 15.99,46.15; I2S5 18.53,48.69; I2S6 18.53,46.15; I2S7 21.07,48.69; I2S8 21.07,46.15 | drill 2.75 pad 6.2: PE_BL 3.5,3.5; PE_BR 61.5,3.5; PE_TL 3.5,52.5; PE_TR 61.5,52.5
SC59-BEC = smd 1 x 1.4: B -0.95,-1.2; C 0,1.2; E 0.95,-1.2
HC49/S = drill 0.813: 1 -2.413,0; 2 2.413,0
R0603 = smd 1 x 1.1: 1 -0.85,0; 2 0.85,0
79523141 = smd 5.2 x 5.2: 1 -12.95,0; 2 12.95,0 | smd 4 x 4: - 0,0
SOIC127P600X175-8N = smd 1.981 x 0.559: 1 -2.464,1.905; 2 -2.464,0.635; 3 -2.464,-0.635; 4 -2.464,-1.905; 5 2.464,-1.905; 6 2.464,-0.635; 7 2.464,0.635; 8 2.464,1.905
PVQFN-16 = smd 1.05 x 0.35: 1 -2.1,0.975; 2 -2.1,0.325; 3 -2.1,-0.325; 4 -2.1,-0.975; 9 2.1,-0.975; 10 2.1,-0.325; 11 2.1,0.325; 12 2.1,0.975 | smd 0.35 x 1.05: 5 -0.975,-2.1; 6 -0.325,-2.1; 7 0.325,-2.1; 8 0.975,-2.1; 13 0.975,2.1; 14 0.325,2.1; 15 -0.325,2.1; 16 -0.975,2.1 | drill 0.4: P$18 0,0; P$19 -0.9,0.9; P$20 0.9,0.9; P$21 0.9,-0.9; P$22 -0.9,-0.9 | smd 2.7 x 2.7: THERMAL 0,0
CC5 = smd 1.1 x 1.9: P$1 0,0; P$2 3.3,0
QFN.24.4X4.MOD = smd 0.838 x 0.305: 1 -1.975,1.25; 2 -1.975,0.75; 3 -1.975,0.25; 4 -1.975,-0.25; 5 -1.975,-0.75; 6 -1.975,-1.25; 13 1.975,-1.25; 14 1.975,-0.75; 15 1.975,-0.25; 16 1.975,0.25; 17 1.975,0.75; 18 1.975,1.25 | smd 0.305 x 0.838: 7 -1.25,-1.975; 8 -0.75,-1.975; 9 -0.25,-1.975; 10 0.25,-1.975; 11 0.75,-1.975; 12 1.25,-1.975; 19 1.25,1.975; 20 0.75,1.975; 21 0.25,1.975; 22 -0.25,1.975; 23 -0.75,1.975; 24 -1.25,1.975
SOIC127P1034X264-18N = smd 1.981 x 0.559: 1 -4.699,5.08; 2 -4.699,3.81; 3 -4.699,2.54; 4 -4.699,1.27; 5 -4.699,0; 6 -4.699,-1.27; 7 -4.699,-2.54; 8 -4.699,-3.81; 9 -4.699,-5.08; 10 4.699,-5.08; 11 4.699,-3.81; 12 4.699,-2.54; 13 4.699,-1.27; 14 4.699,0; 15 4.699,1.27; 16 4.699,2.54; 17 4.699,3.81; 18 4.699,5.08
TSOC6 = smd 0.406 x 1.219: 1 -1.27,-1.6; 2 0,-1.6; 3 1.27,-1.6; 4 1.27,1.6; 5 0,1.6; 6 -1.27,1.6

### Placement (x,y rotation side)
C1  49.53,24.77 270 top
C2  53.34,28.42 180 top
C3  53.98,20.32 0 top
C4  35.56,44.45 90 top
C5  38.1,24.13 180 top
C6  34.29,24.13 0 top
C8  17.78,10 0 top
C9  7.14,18.49 0 top
C10  17.78,14.68 180 top
C11  20.24,28.34 0 top
C12  9.21,28.89 180 top
C13  20.88,30.56 0 top
C15  10.48,24.77 90 top
CON2  0,22.23 270 top
IC1  27.3,20.95 0 top
IC2  50.8,40.64 0 top
IC3  12.7,12.7 180 top
IC4  41.35,44.93 0 top
IC5  34.29,22.7 270 top
JP1  42.86,20.64 270 top
JP2  54.05,47.47 180 top
JP3  38.1,0.64 180 top
JP4  55.88,0.64 180 top
JP7  26.67,1.27 0 top
K1  4.13,6.35 270 top
L4  16.99,23.18 180 top
LBO  1.83,28.97 90 top
LED1  1.91,54.61 90 top
LED2  1.91,15.08 90 top
LED3  1.91,13.65 90 top
LED4  1.91,12.22 90 top
LIPO_OFF  9.92,8.41 180 bottom
PCB1  8.89,0 0 top
PWR  1.91,16.51 90 top
Q1  6.67,32.07 180 top
Q2  38.26,27.78 180 top
R1  6.03,54.61 0 top
R2  49.85,47.47 180 top
R3  33.02,44.45 90 top
R4  7.14,10.79 0 top
R5  11.19,18.41 180 top
R6  17.78,13.18 180 top
R7  17.78,11.59 0 top
R8  7.14,15.08 0 top
R9  7.14,13.65 0 top
R10  7.14,12.22 0 top
R11  38.89,17.46 0 top
R12  35.08,17.46 0 top
R13  35.08,16.03 180 top
R14  41.91,24.13 0 top
R15  7.14,16.51 0 top
R16  6.67,35.08 0 top
R17  11.11,31.11 0 top
R18  11.11,33.34 0 top
R19  20.08,35.72 0 top
R20  20.95,33.1 270 top
R21  5.95,28.97 0 top
R99  17.78,16.27 180 top
SPACER1  5.08,36.83 270 bottom
U1  27.07,35 90 top
U2  16.51,32.38 90 top
U$1  28.73,30.32 180 top
U$2  53.98,24.77 270 top
U$13  38.26,36.2 90 top
ZD1  26.67,13.57 180 top

### Tracks (layer width: path | path; a pad name or v marks a point on that pad's centre or on a via)
BUTTON_DOWN  (via drill 0.3, 0.4)
  Top 0.254: 59.45,14.76 v59.45,15.24 59.45,16.51 59.45,49.61 v59.77,49.93 | JP4.7 v57.15,15.24
  Bottom 0.254: v59.77,49.93 54.12,49.93 PCB1.29 | v57.15,15.24 v59.45,15.24
BUTTON_ENCODER_MENUE  (via drill 0.3)
  Top 0.254: v61.67,49.45 60.8,48.58 60.8,12.86 63.5,10.16 63.5,5.71 JP4.4
  Bottom 0.254: v61.67,49.45 61.67,51.59 62.94,52.86 62.94,53.73 PCB1.38
BUTTON_NEXT  (via drill 0.3, 0.4)
  Top 0.254: 56.28,21.67 v56.2,21.75 56.2,18.26 55.88,17.94 v55.88,8.89 | v56.2,29.13 56.2,45.56 56.59,45.96 56.59,50 PCB1.31 | JP4.5 v59.69,8.89
  Bottom 0.254: v56.2,21.75 v56.2,29.13 | v59.69,8.89 v55.88,8.89
BUTTON_PAUSE  (via drill 0.3, 0.4)
  Top 0.254: v61.67,52.55 61.67,50.48 60.09,48.9 60.09,11.51 v60.01,11.43 | JP4.8 57.78,4.45 58.42,5.08 v58.42,11.43
  Bottom 0.254: v61.67,52.55 56.58,52.55 PCB1.32 | v58.42,11.43 v60.01,11.43
BUTTON_PLAY  (via drill 0.4)
  Top 0.254: PCB1.33 58.9,50.23 58.74,50.08 58.74,28.42 v57.31,26.99 | JP4.6 60.33,4.45 60.96,5.08 60.96,8.89 59.21,10.64 59.21,11.91 57.63,13.49 57.63,14.61 57.94,14.92 57.94,23.34 v57.31,23.97
  Bottom 0.254: v57.31,23.97 v57.31,26.99
BUTTON_PREV  (via drill 0.3, 0.4)
  Top 0.254: v57.15,31.75 57.15,50.32 56.67,50.8 56.67,51.83 57.31,52.47 59.14,52.47 PCB1.36 | JP4.3 v62.23,10.16 | v52.07,10.16 52.07,17.78 v53.34,19.05
  Bottom 0.254: v53.34,19.05 53.34,27.94 v57.15,31.75 | v62.23,10.16 v52.07,10.16
BUTTON_UP  (via drill 0.3, 0.4)
  Top 0.254: PCB1.15 35.04,49.65 v35,49.61 | v31.75,49.69 31.75,44.29 31.51,44.05 31.51,23.5 32.94,22.07 v32.94,17.38 | JP4.9 v54.61,17.38
  Bottom 0.254: v35,49.61 31.83,49.61 v31.75,49.69 | v32.94,17.38 v54.61,17.38
BUTTON_VOL_DOWN  (via drill 0.3, 0.4)
  Top 0.254: v61.44,13.49 61.44,47.94 v62.63,49.13 | v66.83,49.13 66.83,52.46 PCB1.40 | v66.04,13.49 66.04,5.71 JP4.2
  Bottom 0.254: v62.63,49.13 v66.83,49.13 | v61.44,13.49 v66.04,13.49
BUTTON_VOL_UP
  Top 0.254: PCB1.37 63.34,50.87 63.34,48.74 62.07,47.47 62.07,17.94 64.77,15.24 JP4.1
CANH  (via drill 0.4)
  Top 0.254: IC5.7 40.16,21.43 40.56,21.83 | 40.56,21.83 40.8,22.07 40.8,23.87 R14.1 | v40.96,20.95 40.96,21.43 40.56,21.83 | JP4.13 v49.53,20.64
  Bottom 0.254: v49.53,20.64 41.27,20.64 v40.96,20.95
CANL  (via drill 0.4)
  Top 0.254: JP1.2 41.75,19.37 40.96,20.16 IC5.6 | JP4.14 48.26,5.71 48.26,18.89 v48.42,19.05
  Bottom 0.254: v48.42,19.05 43.18,19.05 JP1.2
CANRX  (via drill 0.4)
  Top 0.254: U$13.2 v34.45,29.05 | 35.88,17.52 R12.2 | R13.1 R12.2 | v36.67,20.95 36.67,18.2 R12.2
  Bottom 0.254: v34.45,29.05 34.45,23.18 v36.67,20.95
CANTX
  Top 0.254: IC5.1 33.02,22.7 32.07,23.65 32.07,30.39 U$13.1
ENABLE
  Top 0.254: R16.2 14.45,35.08 14.92,35.56 15.88,35.56 16.19,35.24 16.19,34.49 U2.11
ENCODER_1  (via drill 0.3, 0.4)
  Top 0.254: v32.23,16.59 32.23,21.99 30.96,23.26 30.96,44.37 31.11,44.53 31.11,50.48 31.19,50.56 v31.19,52.47 | JP4.10 53.98,4.45 53.34,5.08 v53.34,16.59
  Bottom 0.254: v53.34,16.59 v32.23,16.59 | v31.19,52.47 33.74,52.47 PCB1.16
GND  (via drill 0.3)  (4 unrouted)
  Top 0.254: C1.2 49.63,24.02 U$2.11 52.86,24.02 | C3.2 54.83,21.49 55.24,21.91 55.24,22.77 U$2.18 55.24,23.17 55.17,23.57 54.73,24.02 52.86,24.02 | U$2.9 52.77,25.02 52.86,24.92 52.86,24.02 | IC3.EP 14.37,11.03
  Top 0.305: U2.7 U2.6 U2.5 17.48,31.41 U2.P$22 | U2.10 16.84,33.86 U2.P$21 | U2.13 15.54,33.36 U2.P$20 | IC3.10 IC3.9 | C11.2 C13.2
  Top 0.406: IC2.1 IC2.2 IC2.3 IC2.4 | IC3.EP 12.7,12.94 11.67,13.97 11.67,14.63 IC3.10 | v5,36.75 5,36.91
  Top 0.61: IC1.7 IC1.8
  Bottom 0.406: SPACER1.- v5,36.75 | v25.32,34.21 v22.62,34.21
  pour Top: -6.35,63.5 105.41,63.5 105.41,-5.08 -6.35,-5.08
ID_SCL
  Top 0.254: IC2.6 51.44,45.01 51.99,45.56 53.34,45.56 53.98,46.2 53.98,48.82 53.42,49.37 51.75,49.37 51.44,49.69 51.44,52.62 PCB1.28
ID_SDA
  Top 0.254: PCB1.27 50.28,48.93 49.85,48.5 49.85,46.12 49.53,45.8 49.53,42.55 49.93,42.15 52.31,42.15 52.7,42.55 IC2.5
LBO
  Top 0.254: U2.12 8.84,34.48 Q1.B
LCD_TS_CS  (via drill 0.3, 0.4)
  Top 0.254: v47.7,11.43 47.7,49.37 46.51,50.56 46.51,52.54 PCB1.26 | JP3.10 33.66,4.45 34.29,5.08 v34.29,11.43
  Bottom 0.254: v34.29,11.43 v47.7,11.43
  other vias: 33.02,4.45
MCP_CS  (via drill 0.4)
  Top 0.254: U$13.16 35.72,42.07 36.2,42.55 36.83,42.55 37.47,43.18 37.47,49.21 38.89,50.64 v38.89,52.39
  Bottom 0.254: v38.89,52.39 43.82,52.39 PCB1.24
MCP_OSC1
  Top 0.254: U$13.8 42.07,29.18 Q2.1 38.98,26.08 C5.1
MCP_OSC2
  Top 0.254: C6.1 33.34,24.21 33.34,25.56 35.56,27.78 Q2.2 37.78,27.78 40.8,30.8 U$13.7
N$1  (via drill 0.3)  (1 unrouted)
  Top 0.254: U1.3 v27.7,35 | v22.54,35.56 v22.54,40.4
  Bottom 0.254: v27.7,35 23.1,35 v22.54,35.56 | v22.54,40.4 1.51,40.4 1.27,40.64 1.27,45.72
  Bottom 1.27: SPACER1.2 5.08,26.67 1.27,30.48 1.27,45.72 5.08,49.53
N$2
  Top 0.254: JP7.5 ZD1.5
  Top 0.406: JP7.5 JP7.2
N$3
  Top 0.254: U$2.10 51.05,24.52 50.16,25.4 49.74,25.4 C1.1
N$4
  Top 0.254: U$2.1 55.23,27.41 C2.1
N$5
  Top 0.254: IC2.7 50.16,45.56 50.7,46.09 R2.1 JP2.2
N$6
  Top 0.254: U$13.17 34.45,39.85 33.81,39.21 32.86,39.21 32.07,40.01 32.07,43.97 32.23,44.13 32.23,44.51 R3.2
N$7
  Top 0.406: LED1.A R1.1
N$9
  Top 0.406: L4.2 16.84,28.44 U2.3 U2.4
N$10
  Top 0.254: IC1.2 26.67,17.14 27.94,15.88 ZD1.1
N$12
  Top 0.254: R99.2 16.51,16.27 15.8,15.56 15.8,14.83 IC3.5
N$13  (via drill 0.3)
  Top 0.254: R4.2 v9.92,10.79 | v9.92,12.7 IC3.13
  Bottom 0.254: v9.92,10.79 v9.92,12.7
N$14
  Top 0.254: IC3.12 10.29,13.2 9.92,13.49 9.92,18 R5.2
N$15
  Top 0.254: IC3.2 15.14,12.2 15.32,12.38 16.14,12.38 | 16.14,12.38 R7.1 | R6.2 16.14,12.38
N$16
  Top 0.254: ZD1.6 27.94,10.69 JP7.4
  Top 0.406: JP7.4 JP7.3
N$17
  Top 0.254: LED2.A R8.1
N$18
  Top 0.254: LED3.A R9.1
N$19
  Top 0.254: LED4.A R10.1
N$20  (via drill 0.3)
  Top 0.254: LED4.C v1.75,12.22 | IC3.8 12.7,15.48 v12.3,15.88
  Bottom 0.254: v1.75,12.22 4.21,14.68 6.03,14.68 7.3,15.88 v12.3,15.88
N$21  (via drill 0.3)
  Top 0.254: LED3.C v1.75,13.65 | IC3.7 13.2,16.17 v12.86,16.51
  Bottom 0.254: v1.75,13.65 3.33,15.24 5.79,15.24 7.14,16.51 v12.86,16.51
N$22  (via drill 0.3)
  Top 0.254: LED2.C v1.75,15.08 | IC3.6 13.7,16.86 v13.41,17.14
  Bottom 0.254: v1.75,15.08 2.46,15.8 5.56,15.8 6.91,17.14 12.7,17.14 v13.41,17.14
N$23
  Top 0.254: U2.9 20.42,34.48 R20.1 R19.2
N$24  (via drill 0.3)
  Top 0.254: PWR.C v1.75,16.51 | v4.92,16.51 R15.1
  Bottom 0.254: v1.75,16.51 2.46,17.22 4.21,17.22 v4.92,16.51
N$25
  Top 0.254: R18.2 12.53,33.33 10.32,31.11 R17.1
  Top 0.305: U2.14 13.16,32.71 R18.2
N$26
  Top 0.406: R21.1 LBO.A
N$27
  Top 0.254: Q1.C 6.67,29.11 R21.2
N$28
  Top 0.254: R11.1 38.04,22.01 38.73,22.7 IC5.8
N$29
  Top 0.254: R14.2 42.76,22.01 JP1.1
P3V3  (via drill 0.3, 0.4)
  Top 0.254: C3.1 53.12,21.17 52.7,21.59 52.7,22.77 | 52.7,22.77 U$2.13 | IC1.1 v25.4,16.59 | IC2.8 49,43.82 R2.2 49,48.4 v48.9,48.5 | 52.7,22.77 52.46,22.77 v52.15,22.46 | U$2.8 51.48,25.52 v50.96,26.04 | U1.8 25.16,35.96 v25.4,35.72 | U$13.18 33.18,43.44 R3.1 33.05,43.58 C4.1 36.44,43.58 v36.67,43.34
  Top 0.406: R1.2 6.88,53.71 v6.83,53.66 | JP7.6 JP7.1 24.13,4.92 v25.24,3.81
  Bottom 0.254: v25.4,16.59 25.4,16.91 | v48.9,48.5 48.9,48.74 49.05,48.9 | v52.15,22.46 52.15,22.23 52.07,22.15 | v25.4,35.72 25.4,35.48 | v36.67,43.34 36.51,43.34
  Bottom 0.406: v6.83,53.66 6.83,53.42 | v25.24,3.81 25.24,3.41
  pour Bottom: 25.4,63.5 109.22,66.04 109.22,-8.89 24.77,-8.89 24.77,39.37 -1.27,39.37 -1.27,63.5
P5V  (via drill 0.3, 0.4)
  Top 0.254: IC3.20 14.34,10.11 v14.37,10.08 | IC3.1 15.37,11.7 v15.56,11.59 | IC3.4 15.38,13.2 v15.4,13.18 15.72,13.49 15.72,13.81 16.59,14.68 C10.2 | PWR.A 4.05,16.51 v5.16,17.62 | IC5.3 v35.56,20.16
  Top 0.305: U2.16 12.83,31.41 R17.2 12.7,30.95 12.7,29.84 11.75,28.89 C12.1 | U2.15 U2.16 | U2.1 15.12,30.29 14.61,30.8 14.61,31.21 U2.16
  Top 0.406: v18.49,47.31 v18.49,38.34
  Top 0.61: C12.1 10.48,28.5 C15.+ 12.03,26.39 v12.06,26.35
  Bottom 0.254: v14.37,10.08 14.29,10 | v15.56,11.59 15.56,11.67 | v15.4,13.18 15.56,13.18 | v5.16,17.62 5.32,17.62 | v35.56,20.16 30.16,20.16 29.53,20.8 23.97,20.8
  Bottom 0.406: PCB1.4 19.72,53.77 18.49,52.55 | 18.49,52.55 v18.49,47.31 | v18.49,38.34 18.49,37.94 | PCB1.2 17.27,53.77 18.49,52.55
  Bottom 0.61: v12.06,26.35 12.46,26.35
  pour Bottom (isolate 0.254): 24.13,-2.54 24.13,38.73 -2.54,38.73 -2.54,57.15 -25.4,57.15 -24.13,-2.54
PBAT
  Top 0.254: IC3.14 IC3.15 IC3.16
  Top 0.406: U2.8 19.84,33.36 R20.2
  Top 0.61: CON2.2 4.8,23.18 7.62,23.18 8.1,22.7 8.1,20.24 8.02,20.16 C9.2 8.81,18.49 9.13,18.18 | 9.13,18.18 9.13,12.3 9.68,11.75 10.29,11.75 IC3.15 | 9.13,18.18 9.13,20.08 10,20.95 18.11,20.95 L4.1 20.34,26.84 C11.1 20,29.5 C13.1 20,31.3 R20.2
RPI_1WIRE  (via drill 0.3)
  Top 0.254: PCB1.7 23.57,49.93 v23.57,44.13
  Bottom 0.254: v23.57,44.13 38.02,44.13 38.34,43.81 40.24,43.81 IC4.2
RPI_MISO  (via drill 0.3, 0.4)
  Top 0.254: v45.72,14.61 v45.72,37.94 45.72,49.37 45.24,49.85 44.04,49.85 PCB1.21 | U$13.15 v36.99,37.94 | v35.56,14.61 JP3.7
  Bottom 0.254: v35.56,14.61 v45.72,14.61 | v36.99,37.94 v45.72,37.94
RPI_MOSI  (via drill 0.3, 0.4)
  Top 0.254: v45.01,9.13 v45.01,38.89 45.01,48.66 44.53,49.13 42.22,49.13 PCB1.19 | U$13.14 v38.26,38.89 | v36.83,8.89 36.83,5.71 JP3.8
  Bottom 0.254: v38.26,38.89 v45.01,38.89 | v45.01,9.13 37.07,9.13 v36.83,8.89
RPI_RX  (via drill 0.3)
  Top 0.254: v30.8,15.24 30.8,21.99 29.92,22.86 29.92,44.13 28.65,45.4 28.65,52.54 PCB1.10 | JP3.3 40.64,15.16 v40.72,15.24
  Bottom 0.254: v40.72,15.24 v30.8,15.24
RPI_SCK  (via drill 0.3, 0.4)
  Top 0.254: v46.51,13.34 v46.51,36.67 46.51,49.92 PCB1.23 | U$13.13 v39.53,36.83 | JP3.9 v33.02,13.34
  Bottom 0.254: v33.02,13.34 v46.51,13.34 | v39.53,36.83 46.35,36.83 v46.51,36.67
RPI_SCL  (via drill 0.3, 0.4)
  Top 0.254: v20.48,42.31 20.48,49.37 PCB1.5 | v24.45,42.31 v24.45,40.4 v24.45,20.08 | v29.21,20.08 IC1.4 29.21,12.7 30.48,11.43 v30.48,10.16 | U1.6 v27.7,40.4 | JP3.5 v38.1,10.16 | U$2.23 56.56,25.52 56.67,25.4 56.67,22.38 56.99,22.07 56.99,21.43 56.67,21.11 v56.67,16.03 | v50.48,15.88 v50.48,10.16
  Bottom 0.254: v24.45,20.08 v29.21,20.08 | v27.7,40.4 v24.45,40.4 | v20.48,42.31 v24.45,42.31 | v30.48,10.16 v38.1,10.16 v50.48,10.16 | v56.67,16.03 53.98,16.03 53.82,15.88 v50.48,15.88
RPI_SDA  (via drill 0.3)
  Top 0.254: v19.76,41.43 19.76,51.19 PCB1.3 | v23.81,41.43 v23.81,38.97 v23.81,28.57 | v29.21,28.57 IC1.5 29.21,22.86 30,22.07 30,14.45 v30.48,13.97 | v58.42,13.97 58.42,24.92 57.31,26.04 55.97,26.04 U$2.24 | U1.5 v28.97,39.05 | v38.1,13.97 39.37,12.7 39.37,5.71 JP3.6
  Bottom 0.254: v23.81,28.57 v29.21,28.57 | v30.48,13.97 v38.1,13.97 v58.42,13.97 | v28.97,39.05 23.89,39.05 v23.81,38.97 | v23.81,41.43 v19.76,41.43
RPI_TX  (via drill 0.3, 0.4)
  Top 0.254: v31.51,12.38 31.51,21.91 30.4,23.02 v30.4,44.77 | v26.19,44.77 26.19,52.46 PCB1.8 | JP3.4 41.27,4.45 41.91,5.08 v41.91,12.38
  Bottom 0.254: v41.91,12.38 v31.51,12.38 | v30.4,44.77 v26.19,44.77
RXASD
  Top 0.254: R12.1 34.23,18.74 IC5.4
STATUS_LED
  Top 0.254: 30,53.73 PCB1.12 28.01,55.72 16.83,55.72 15.88,54.77 15.88,50.88 13.89,48.9 10.64,48.9 8.81,50.72 8.81,55.09 8.18,55.72 1.59,55.72 1.03,55.16 LED1.C
VBAT
  Top 0.406: R16.1 5.82,33.37 Q1.E
VUSB  (via drill 0.3)
  Top 0.254: R8.2 R9.2 R10.2 7.38,12.22 7.14,11.99 7.14,8.49 7.06,8.41 | IC3.17 12.68,10.73 12.7,10.72
  Top 0.305: IC3.19 IC3.18 IC3.17
  Top 0.406: K1.1 5.67,7.65 5.71,7.7
  Top 0.61: 12.7,10.72 12.7,8.49 12.78,8.41
  Top 1.016: C8.2 18.63,10.03 R7.2 18.63,8.95 18.1,8.41 17.78,8.41 | 17.78,8.41 12.78,8.41 v11.43,8.41 | v11.43,8.41 7.06,8.41 6.43,8.41 5.71,7.7 | 18.1,8.1 17.78,8.41 | v11.43,8.41 12.22,8.41
  Bottom 1.016: LIPO_OFF.2 v11.43,8.41
X1
  Top 0.254: U1.1 25.16,30.59 U$1.P$2
X2
  Top 0.254: U1.2 26.43,31.19 27.3,30.32 U$1.P$1

### Text on the board
tNames: STATUS | 1W-TEMP | RTC | BOOST | ID EEPROM | MPU | 1WIRE | UEXT | BUTTONS | LIPO CHARGER
bNames: LIPO OFF
tDocu: GYRO | ID EEPROM